# Altium schematic sheet power_deliver_diagram.SchDoc: Power Deliver Diagram
size B; Organization: Altium Limited; Address1: L3, 12a Rodborough Rd; Address2: Frenchs Forest; Address3: NSW; Address4: Australia 2086; Revision: A; SheetNumber: 3; SheetTotal: 7
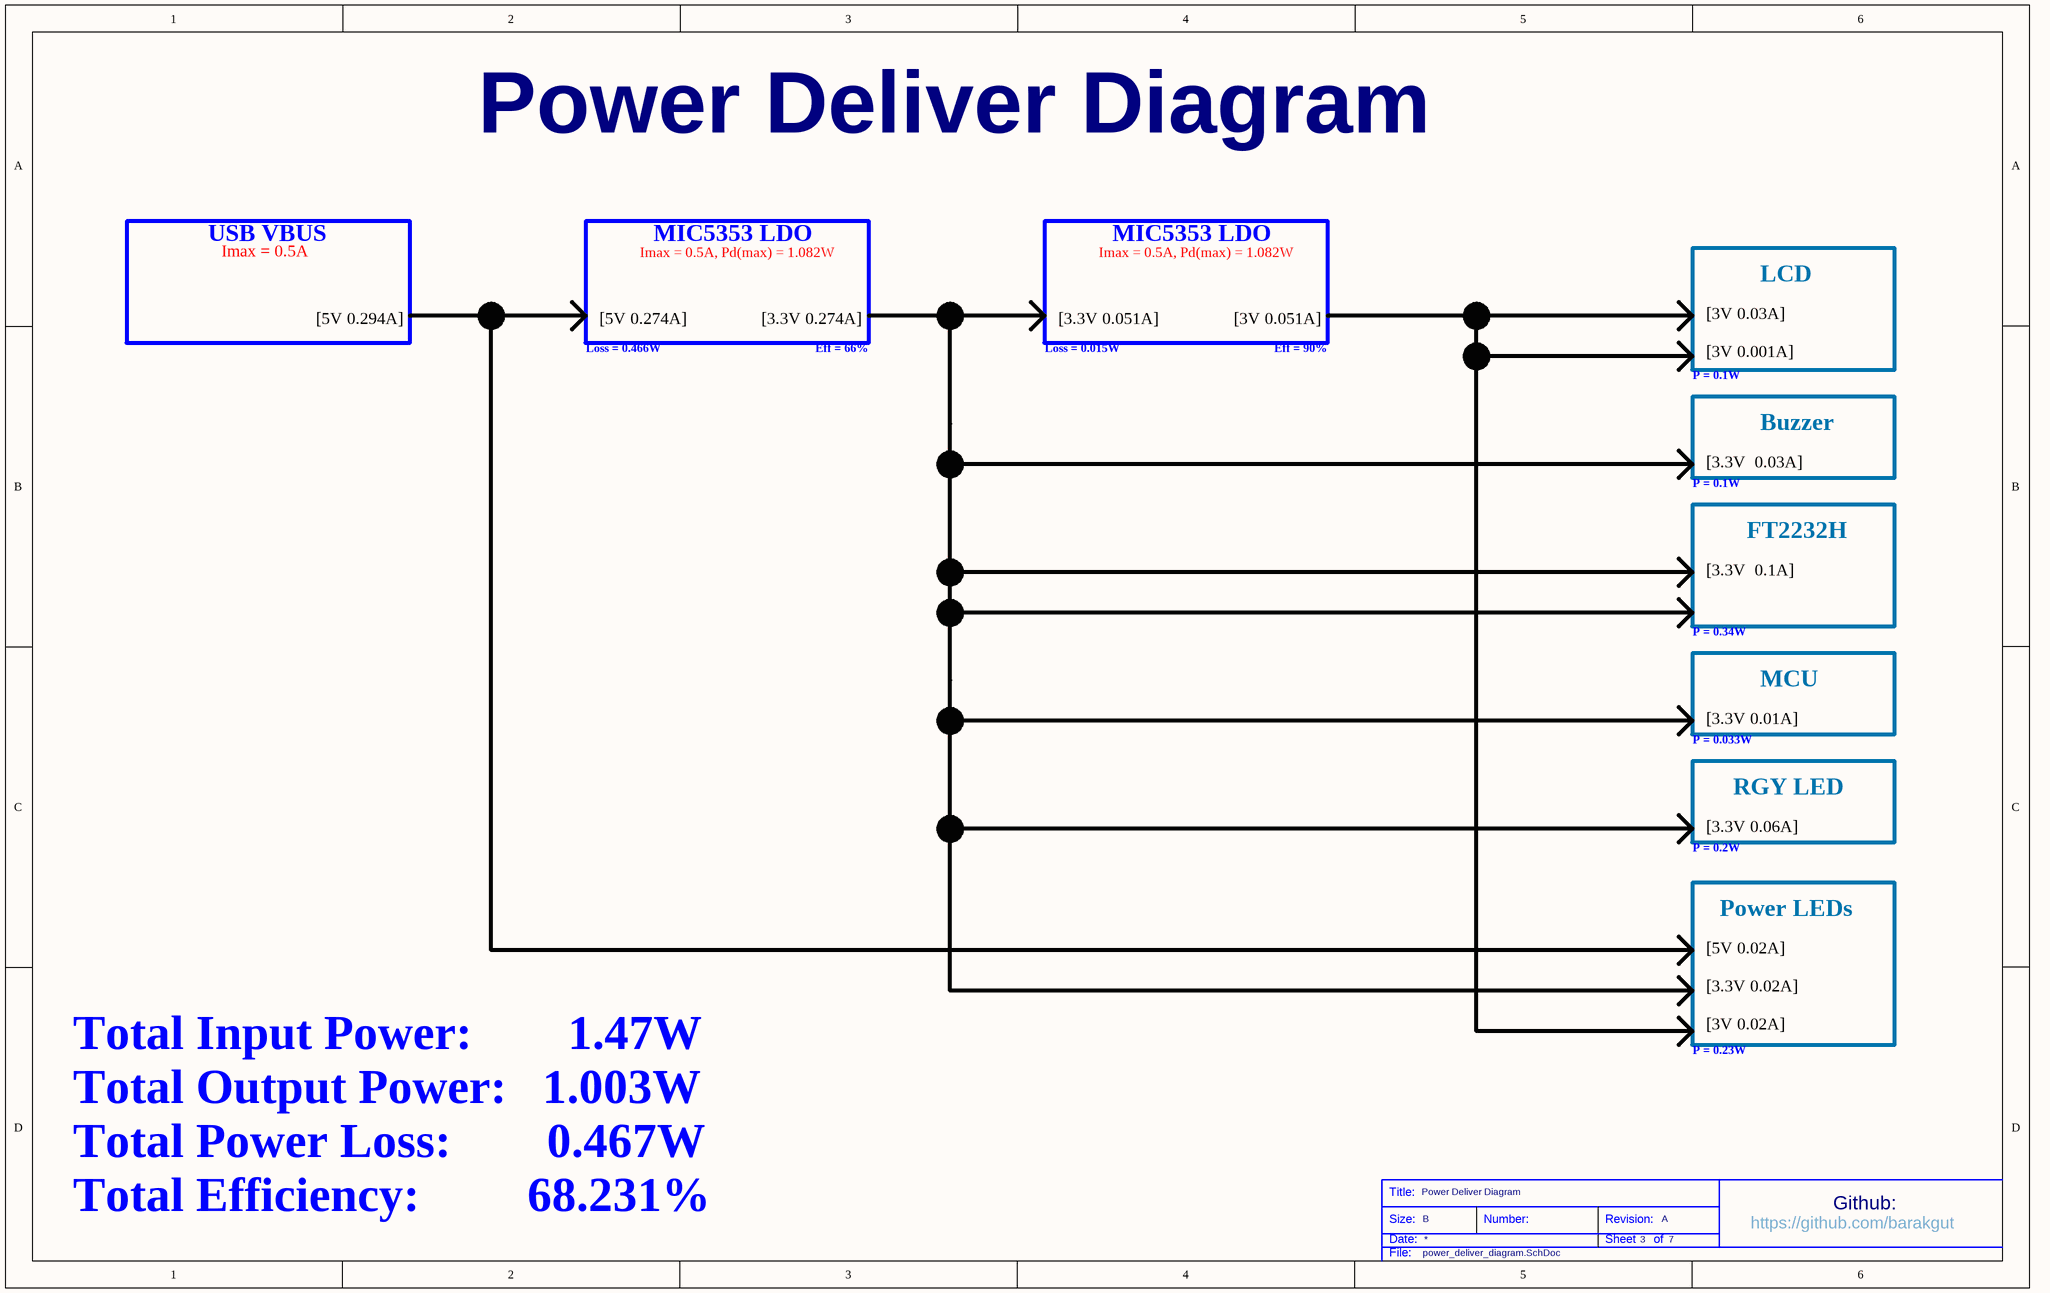
[diagram p0: power_deliver_diagram.SchDoc]

## Notes on the sheet
- Power Deliver Diagram
- USB VBUS
- Imax = 0.5A
- Imax = 0.5A, Pd(max) = 1.082W
- MIC5353 LDO
- LCD
- [5V 0.294A]
- Loss = 0.466W
- [5V 0.274A]
- [3.3V 0.274A]
- Eff = 66%
- Loss = 0.015W
- [3.3V 0.051A]
- [3V 0.051A]
- Eff = 90%
- [3V 0.03A]
  [3V 0.001A]
- P = 0.1W
- Buzzer
- [3.3V  0.03A]
- FT2232H
- P = 0.34W
- [3.3V  0.1A]
  [3.3V 0.003A]
- MCU
- P = 0.033W
- [3.3V 0.01A]
- [3.3V 0.06A]
- RGY LED
- P = 0.2W
- Power LEDs
- [5V 0.02A]
  [3.3V 0.02A]
  [3V 0.02A]
- P = 0.23W
- Total Input Power:        1.47W
  Total Output Power:   1.003W
  Total Power Loss:        0.467W
  Total Efficiency:         68.231%
- Title:
- Size:
- Date:
- B
- Number:
- Revision:
- Sheet
- of
- https://github.com/barakgut
- Github:
- File: